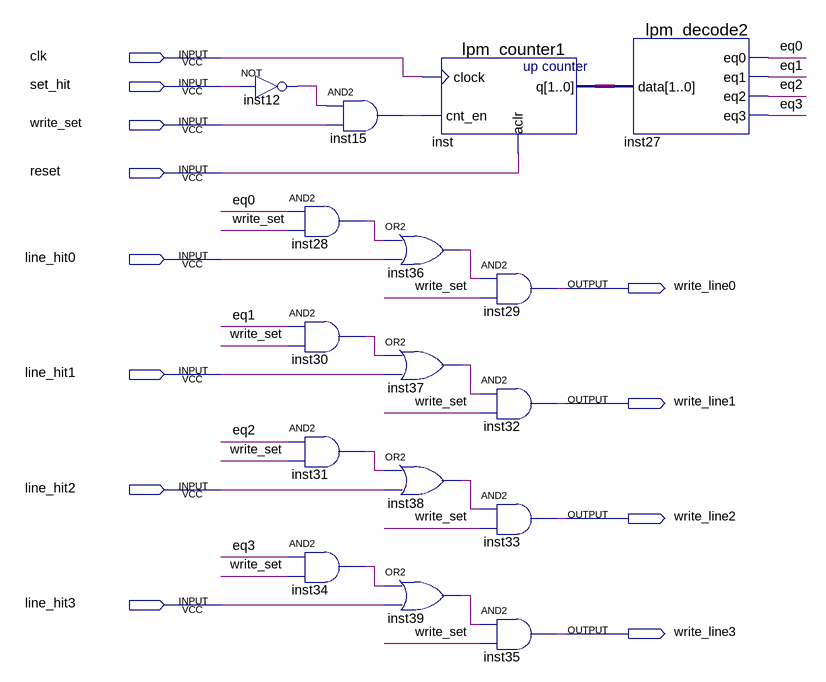
[diagram p0: schematic sheet]
// Quartus schematic cache_set_controller.bdf as structural Verilog: 16 symbols, 12 pins
module cache_set_controller (
  input  clk,
  input  set_hit,
  input  write_set,
  input  reset,
  input  line_hit0,
  input  line_hit1,
  input  line_hit2,
  input  line_hit3,
  output write_line0,
  output write_line1,
  output write_line2,
  output write_line3
);

  wire eq0, eq1, eq2, eq3, inst12_out, inst15_out, inst28_out, inst30_out, inst31_out, inst34_out,
       inst36_out, inst37_out, inst38_out, inst39_out;
  wire [1:0] inst_q;

  not inst12 (inst12_out, set_hit);
  and inst28 (inst28_out, eq0, write_set);
  and inst30 (inst30_out, eq1, write_set);
  and inst31 (inst31_out, eq2, write_set);
  and inst34 (inst34_out, eq3, write_set);
  and inst15 (inst15_out, inst12_out, write_set);
  lpm_counter1 inst (.clock(clk), .cnt_en(inst15_out), .aclr(reset), .q(inst_q));
  or inst36 (inst36_out, inst28_out, line_hit0);
  or inst37 (inst37_out, inst30_out, line_hit1);
  or inst38 (inst38_out, inst31_out, line_hit2);
  or inst39 (inst39_out, inst34_out, line_hit3);
  and inst29 (write_line0, inst36_out, write_set);
  and inst32 (write_line1, inst37_out, write_set);
  and inst33 (write_line2, inst38_out, write_set);
  and inst35 (write_line3, inst39_out, write_set);
  lpm_decode2 inst27 (.data(inst_q), .eq0(eq0), .eq1(eq1), .eq2(eq2), .eq3(eq3));
endmodule
